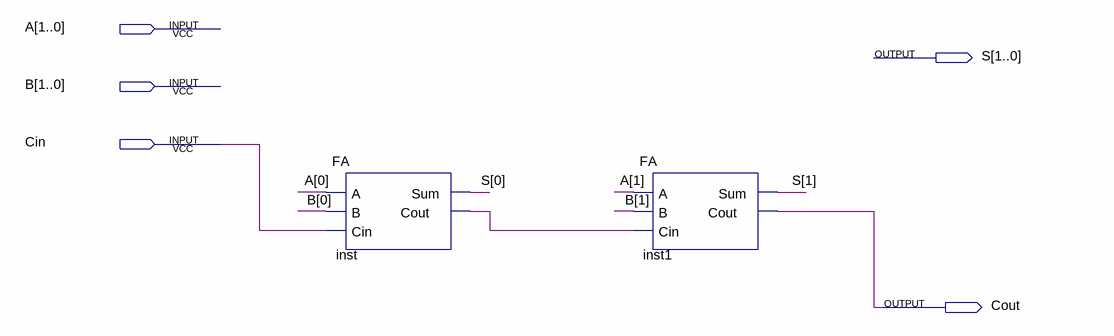
[diagram p0: schematic sheet]
// Quartus schematic FA2.bdf as structural Verilog: 2 symbols, 5 pins
module FA2 (
  input  [1:0] A,
  input  [1:0] B,
  input  Cin,
  output [1:0] S,
  output Cout
);

  wire inst_cout;

  FA inst (.A(A[0]), .B(B[0]), .Cin(Cin), .Sum(S[0]), .Cout(inst_cout));
  FA inst1 (.A(A[1]), .B(B[1]), .Cin(inst_cout), .Sum(S[1]), .Cout(Cout));
endmodule
